# EAGLE board Control_Board (EAGLE 7.5.0), part 1 of 2
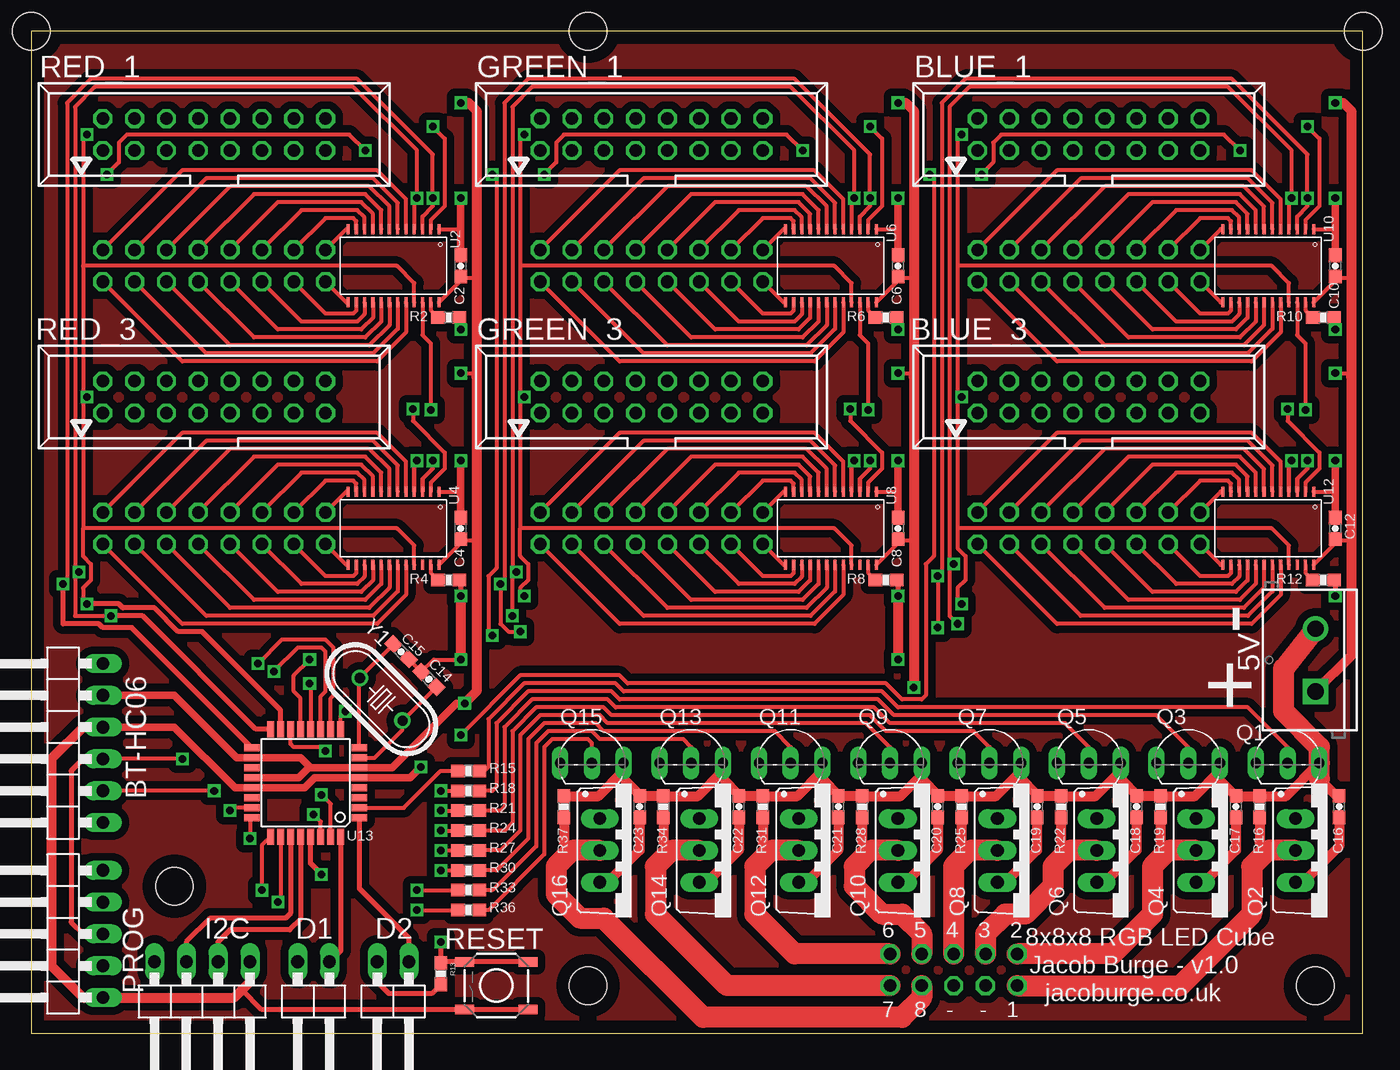
[diagram p1: board, top side]
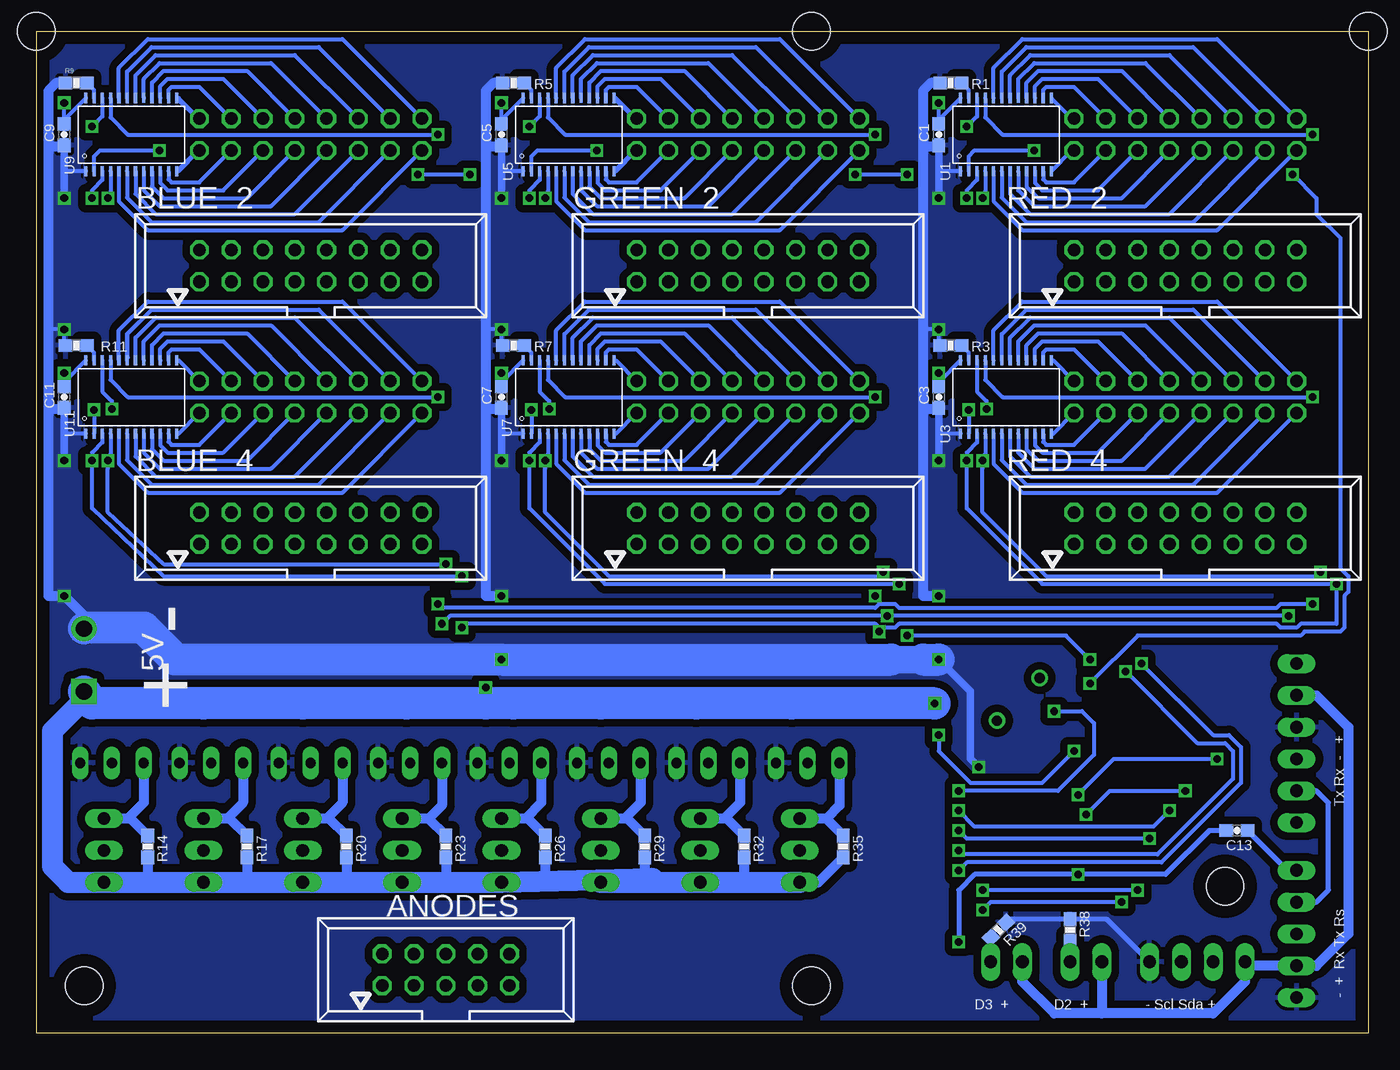
[diagram p2: board, bottom side, seen from below]

Size 106.35 x 80 mm. Coordinates in mm from the lower left corner, seen from the top.
Outline: 0,0 106.35,0 106.35,80 0,80 0,0
Copper layers (1*16): Top 0.035mm / dielectric 1.5mm / Bottom 0.035mm
Design rules "default": minimum track width 10mil, minimum drill 24mil, track to track 8mil, track to pad 8mil, pad to pad 8mil, via to via 8mil, smd to smd 8mil, copper to edge 40mil, drill to drill 8mil, minimum pad ring 10mil, minimum via ring 8mil, stop-mask expansion 4mil, vias tented up to drill 0mil, thermal gap 10mil
Holes 3 mm at 102.55,3.81 44.45,3.81 11.43,11.75 0,80.01 106.36,80.01 44.45,80.01

## Footprints (pad centres in the part's own frame; a part is rotated, then mirrored left to right if it is on the bottom)
057-010-1 = drill 1 octagon: 1 -5.08,-1.27; 2 -5.08,1.27; 3 -2.54,-1.27; 4 -2.54,1.27; 5 0,-1.27; 6 0,1.27; 7 2.54,-1.27; 8 2.54,1.27; 9 5.08,-1.27; 10 5.08,1.27
057-016-1 = drill 1 octagon: 1 -8.89,-1.27; 2 -8.89,1.27; 3 -6.35,-1.27; 4 -6.35,1.27; 5 -3.81,-1.27; 6 -3.81,1.27; 7 -1.27,-1.27; 8 -1.27,1.27; 9 1.27,-1.27; 10 1.27,1.27; 11 3.81,-1.27; 12 3.81,1.27; 13 6.35,-1.27; 14 6.35,1.27; 15 8.89,-1.27; 16 8.89,1.27
1X06/90 = drill 1.016 long: 1 -6.35,-3.81; 2 -3.81,-3.81; 3 -1.27,-3.81; 4 1.27,-3.81; 5 3.81,-3.81; 6 6.35,-3.81
0603-CAP = smd 1.1 x 1: 1 -0.85,0; 2 0.85,0
1X02/90 = drill 1.016 long: 1 -1.27,-3.81; 2 1.27,-3.81
1X04/90 = drill 1.016 long: 1 -3.81,-3.81; 2 -1.27,-3.81; 3 1.27,-3.81; 4 3.81,-3.81
SCREWTERMINAL-5MM-2 = drill 1.3 pad 2.032 square: 1 0,0 | drill 1.3 pad 2.032: 2 5,0
1X05/90 = drill 1.016 long: 1 -5.08,-3.81; 2 -2.54,-3.81; 3 0,-3.81; 4 2.54,-3.81; 5 5.08,-3.81
TO92-EBC = drill 0.813 long: B 0,-1.27; C -2.54,-1.27; E 2.54,-1.27
TO220BV = drill 1.016 long: D 0,-2.54; G -2.54,-2.54; S 2.54,-2.54
0603-RES = smd 1.1 x 1: 1 -0.85,0; 2 0.85,0
TACTILE_SWITCH_SMD = smd 1.524 x 0.762: 1 -2.54,1.905; 2 2.54,1.905; 3 -2.54,-1.905; 4 2.54,-1.905
TSSOP-24 = smd 0.8 x 0.25: 1 -2.921,3.353; 2 -2.921,2.692; 3 -2.921,2.032; 4 -2.921,1.372; 5 -2.921,0.711; 6 -2.921,0.051; 7 -2.921,-0.61; 8 -2.927,-1.27; 9 -2.921,-1.93; 10 -2.921,-2.591; 11 -2.921,-3.251; 12 -2.921,-3.912; 13 2.921,-3.912; 14 2.921,-3.251; 15 2.921,-2.591; 16 2.921,-1.93; 17 2.927,-1.27; 18 2.921,-0.61; 19 2.921,0.051; 20 2.921,0.711; 21 2.921,1.372; 22 2.921,2.032; 23 2.921,2.692; 24 2.921,3.353
TQFP32-08 = smd 1.27 x 0.559: 1 -4.293,2.8; 2 -4.293,2; 3 -4.293,1.2; 4 -4.293,0.4; 5 -4.293,-0.4; 6 -4.293,-1.2; 7 -4.293,-2; 8 -4.293,-2.8; 17 4.293,-2.8; 18 4.293,-2; 19 4.293,-1.2; 20 4.293,-0.4; 21 4.293,0.4; 22 4.293,1.2; 23 4.293,2; 24 4.293,2.8 | smd 0.559 x 1.27: 9 -2.8,-4.293; 10 -2,-4.293; 11 -1.2,-4.293; 12 -0.4,-4.293; 13 0.4,-4.293; 14 1.2,-4.293; 15 2,-4.293; 16 2.8,-4.293; 25 2.8,4.293; 26 2,4.293; 27 1.2,4.293; 28 0.4,4.293; 29 -0.4,4.293; 30 -1.2,4.293; 31 -2,4.293; 32 -2.8,4.293
HC49U-V = drill 0.813: 1 -2.413,0; 2 2.413,0

## Placement (x,y rotation side)
ANODES  057-010-1  [057-010-1]  73.66,5.08 0 bottom
BLUE_1  057-016-1  [057-016-1]  84.45,71.75 0 top
BLUE_2  057-016-1  [057-016-1]  84.45,61.28 0 bottom
BLUE_3  057-016-1  [057-016-1]  84.45,50.8 0 top
BLUE_4  057-016-1  [057-016-1]  84.45,40.32 0 bottom
BT-HC06  [1X06/90]  1.9,23.18 90 top
C1  0.1uF  [0603-CAP]  34.29,71.75 270 bottom
C2  0.1uF  [0603-CAP]  34.29,61.28 90 top
C3  0.1uF  [0603-CAP]  34.29,50.8 270 bottom
C4  0.1uF  [0603-CAP]  34.29,40.32 90 top
C5  0.1uF  [0603-CAP]  69.22,71.75 270 bottom
C6  0.1uF  [0603-CAP]  69.22,61.28 90 top
C7  0.1uF  [0603-CAP]  69.22,50.8 270 bottom
C8  0.1uF  [0603-CAP]  69.22,40.32 90 top
C9  0.1uF  [0603-CAP]  104.14,71.75 270 bottom
C10  0.1uF  [0603-CAP]  104.14,61.28 90 top
C11  0.1uF  [0603-CAP]  104.14,50.8 270 bottom
C12  0.1uF  [0603-CAP]  104.14,40.32 90 top
C13  0.1uF  [0603-CAP]  10.48,16.19 180 bottom
C14  2.2uF  [0603-CAP]  31.75,28.26 315 top
C15  2.2uF  [0603-CAP]  29.53,30.48 135 top
C16  0.1uF  [0603-CAP]  104.46,18.1 90 top
C17  0.1uF  [0603-CAP]  96.2,18.1 90 top
C18  0.1uF  [0603-CAP]  88.27,18.1 90 top
C19  0.1uF  [0603-CAP]  80.33,18.1 90 top
C20  0.1uF  [0603-CAP]  72.39,18.1 90 top
C21  0.1uF  [0603-CAP]  64.45,18.1 90 top
C22  0.1uF  [0603-CAP]  56.52,18.1 90 top
C23  0.1uF  [0603-CAP]  48.58,18.1 90 top
D1  [1X02/90]  22.54,1.91 180 top
D2  [1X02/90]  28.89,1.91 180 top
GREEN_1  057-016-1  [057-016-1]  49.53,71.75 0 top
GREEN_2  057-016-1  [057-016-1]  49.53,61.28 0 bottom
GREEN_3  057-016-1  [057-016-1]  49.53,50.8 0 top
GREEN_4  057-016-1  [057-016-1]  49.53,40.32 0 bottom
I2C  [1X04/90]  13.65,1.91 180 top
POWER  M025MM  [SCREWTERMINAL-5MM-2]  102.55,27.3 90 top
PROG  [1X05/90]  1.9,7.94 90 top
Q1  BC548  [TO92-EBC]  100.33,22.86 0 top
Q2  IRF9530  [TO220BV]  103.51,14.61 270 top
Q3  BC548  [TO92-EBC]  92.39,22.86 0 top
Q4  IRF9530  [TO220BV]  95.57,14.61 270 top
Q5  BC548  [TO92-EBC]  84.45,22.86 0 top
Q6  IRF9530  [TO220BV]  87.63,14.61 270 top
Q7  BC548  [TO92-EBC]  76.52,22.86 0 top
Q8  IRF9530  [TO220BV]  79.69,14.61 270 top
Q9  BC548  [TO92-EBC]  68.58,22.86 0 top
Q10  IRF9530  [TO220BV]  71.76,14.61 270 top
Q11  BC548  [TO92-EBC]  60.64,22.86 0 top
Q12  IRF9530  [TO220BV]  63.82,14.61 270 top
Q13  BC548  [TO92-EBC]  52.7,22.86 0 top
Q14  IRF9530  [TO220BV]  55.88,14.61 270 top
Q15  BC548  [TO92-EBC]  44.77,22.86 0 top
Q16  IRF9530  [TO220BV]  47.94,14.61 270 top
R1  1k  [0603-RES]  33.34,75.88 0 bottom
R2  1k  [0603-RES]  33.34,57.15 180 top
R3  1k  [0603-RES]  33.34,54.93 0 bottom
R4  1k  [0603-RES]  33.34,36.2 180 top
R5  1k  [0603-RES]  68.26,75.88 0 bottom
R6  1k  [0603-RES]  68.26,57.15 180 top
R7  1k  [0603-RES]  68.26,54.93 0 bottom
R8  1k  [0603-RES]  68.26,36.2 180 top
R9  1k  [0603-RES]  103.19,75.88 0 bottom
R10  1k  [0603-RES]  103.19,57.15 180 top
R11  1k  [0603-RES]  103.19,54.93 0 bottom
R12  1k  [0603-RES]  103.19,36.2 180 top
R13  10k  [0603-RES]  32.7,4.76 270 top
R14  10k  [0603-RES]  97.47,14.92 270 bottom
R15  1k  [0603-RES]  34.92,20.95 0 top
R16  100  [0603-RES]  98.11,18.1 270 top
R17  10k  [0603-RES]  89.53,14.92 270 bottom
R18  1k  [0603-RES]  34.92,19.37 0 top
R19  100  [0603-RES]  90.17,18.1 270 top
R20  10k  [0603-RES]  81.6,14.92 270 bottom
R21  1k  [0603-RES]  34.92,17.78 0 top
R22  100  [0603-RES]  82.23,18.1 270 top
R23  10k  [0603-RES]  73.66,14.92 270 bottom
R24  1k  [0603-RES]  34.92,16.19 0 top
R25  100  [0603-RES]  74.3,18.1 270 top
R26  10k  [0603-RES]  65.72,14.92 270 bottom
R27  1k  [0603-RES]  34.92,14.61 0 top
R28  100  [0603-RES]  66.36,18.1 270 top
R29  10k  [0603-RES]  57.78,14.92 270 bottom
R30  1k  [0603-RES]  34.92,13.02 0 top
R31  100  [0603-RES]  58.42,18.1 270 top
R32  10k  [0603-RES]  49.85,14.92 270 bottom
R33  1k  [0603-RES]  34.92,11.43 0 top
R34  100  [0603-RES]  50.48,18.1 270 top
R35  10k  [0603-RES]  41.91,14.92 270 bottom
R36  1k  [0603-RES]  34.92,9.84 0 top
R37  100  [0603-RES]  42.55,18.1 270 top
R38  10k  [0603-RES]  23.81,8.26 270 bottom
R39  10k  [0603-RES]  29.53,8.26 225 bottom
RED_1  057-016-1  [057-016-1]  14.61,71.75 0 top
RED_2  057-016-1  [057-016-1]  14.61,61.28 0 bottom
RED_3  057-016-1  [057-016-1]  14.61,50.8 0 top
RED_4  057-016-1  [057-016-1]  14.61,40.32 0 bottom
RESET  SWITCH-MOMENTARY-2SMD  [TACTILE_SWITCH_SMD]  37.15,3.81 180 top
U1  STP16  [TSSOP-24]  29.21,71.75 90 bottom
U2  STP16  [TSSOP-24]  29.21,61.28 270 top
U3  STP16  [TSSOP-24]  29.21,50.8 90 bottom
U4  STP16  [TSSOP-24]  29.21,40.32 270 top
U5  STP16  [TSSOP-24]  64.14,71.75 90 bottom
U6  STP16  [TSSOP-24]  64.14,61.28 270 top
U7  STP16  [TSSOP-24]  64.14,50.8 90 bottom
U8  STP16  [TSSOP-24]  64.14,40.32 270 top
U9  STP16  [TSSOP-24]  99.06,71.75 90 bottom
U10  STP16  [TSSOP-24]  99.06,61.28 270 top
U11  STP16  [TSSOP-24]  99.06,50.8 90 bottom
U12  STP16  [TSSOP-24]  99.06,40.32 270 top
U13  ATMEGA328P  [TQFP32-08]  21.91,20 180 top
Y1  [HC49U-V]  27.94,26.67 315 top